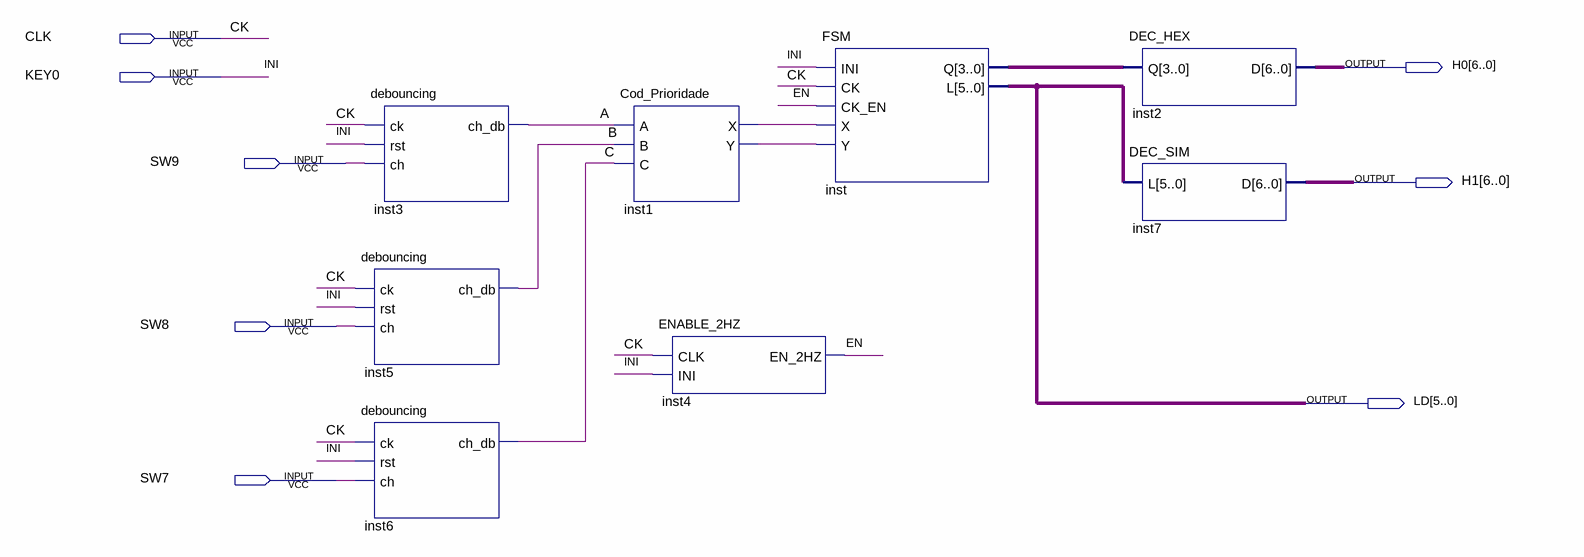
[diagram p0: schematic sheet]
// Quartus schematic PRINCIPAL.bdf as structural Verilog: 8 symbols, 8 pins
module PRINCIPAL (
  input  CLK,
  input  KEY0,
  input  SW9,
  input  SW8,
  input  SW7,
  output [6:0] H0,
  output [6:0] H1,
  output [5:0] LD
);

  wire A, B, C, EN, inst1_x, inst1_y;
  wire [3:0] inst_q;

  debouncing inst3 (.ck(CLK), .rst(KEY0), .ch(SW9), .ch_db(A));
  debouncing inst5 (.ck(CLK), .rst(KEY0), .ch(SW8), .ch_db(B));
  debouncing inst6 (.ck(CLK), .rst(KEY0), .ch(SW7), .ch_db(C));
  Cod_Prioridade inst1 (.A(A), .B(B), .C(C), .X(inst1_x), .Y(inst1_y));
  ENABLE_2HZ inst4 (.CLK(CLK), .INI(KEY0), .EN_2HZ(EN));
  FSM inst (.INI(KEY0), .CK(CLK), .CK_EN(EN), .X(inst1_x), .Y(inst1_y), .Q(inst_q), .L(LD));
  DEC_HEX inst2 (.Q(inst_q), .D(H0));
  DEC_SIM inst7 (.L(LD), .D(H1));

  // Other names for the same wires on the sheet: CK = CLK; INI = KEY0
endmodule
